# Altium schematic sheet BPS_PowerInput_v1-0.SchDoc
size A3
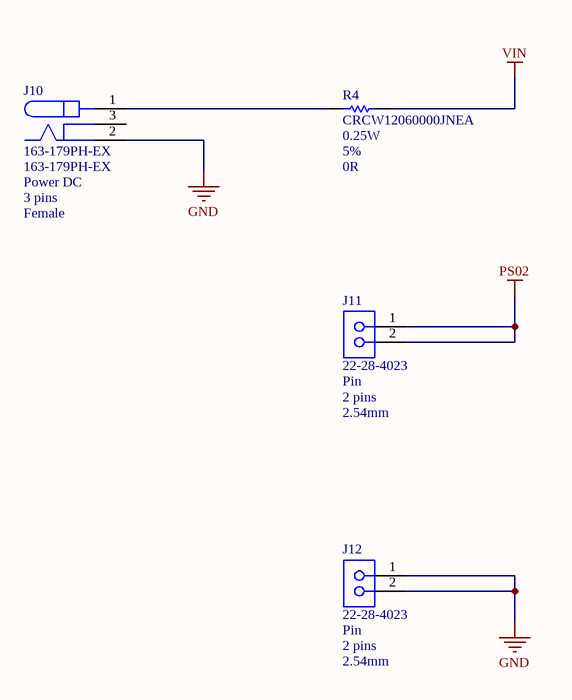
[diagram p0: BPS_PowerInput_v1-0.SchDoc]

## Parts
J10  163-179PH-EX  Type: Power DC  Pins: 3 pins  Gender: Female  [PowerJack_2.1_5.5]
J11  Type: Pin  Pins: 2 pins  Pitch: 2.54mm  [CONSIL02STRMALE_100_100]  (hidden comment: 22-28-4023)
J12  Type: Pin  Pins: 2 pins  Pitch: 2.54mm  [CONSIL02STRMALE_100_100]  (hidden comment: 22-28-4023)
R4  value 0R  PartNumber1: CRCW12060000JNEA  Power: 0.25W  Tolerance: 5%  [RES1206]  (hidden comment: Chip Resistor)

## Nets
GND: J10.2 J12.1 J12.2
PS02: J11.1 J11.2
VIN: R4.1
NetJ10_1: J10.1 R4.2

Not connected (* = marked no-connect by the designer): J10 3

## Notes on the sheet
- Title
- Author
- Checked By
- Size:
- Revision:
- A3
- Date:
- Project
- Time:
- Sheet
- of
- File:

## Library data of the parts
J10 = 163-179PH-EX: DC Power Connectors PCB 2.1MM; Manufacturer1: Kobiconn; Published: 04-Dec-2022; LatestRevisionDate: 04-Dec-2022; PackageReference: PowerJack_2.1_5.5; Publisher: Lucas Moraes; PackageDescription: PowerJack_2.1_5.5; 3 Leads; PartNumber1: 163-179PH-EX
J11 J12 = 22-28-4023: Headers & Wire Housings 02 MODII HDR SRST B/A .100CL; Manufacturer1: Molex; LastRevisionNote: Created; Gender: Male; Published: 15-Set-2017; LatestRevisionDate: 27-Mar-2023; PackageReference: CONSIL02STRMALE_100_100; Publisher: Lucas Moraes; PackageDescription: CONSIL02STRMALE_100_100; 2 Leads; PartNumber1: 22-28-4023
R4 = CRCW1206: Thick Film Chip Resistors with CECC Approval,  available with Established Reliability; LatestRevisionDate: 06-May-2016; PackageReference: 1206; Publisher: Lucas Moraes; PackageDescription: SMD 1206; 2 Leads; Published: 06-May-2016